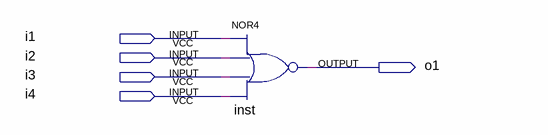
[diagram p0: schematic sheet]
// Quartus schematic nor_4.bdf as structural Verilog: 1 symbols, 5 pins
module nor_4 (
  input  i1,
  input  i2,
  input  i3,
  input  i4,
  output o1
);

  nor inst (o1, i1, i2, i3, i4);
endmodule
